# Altium project Proyecto0.PrjPcb (part 2 of 3)

## Sheet FPGA_Banks.SchDoc
size 558 x 431 mm; DrawnBy: Santiago Rodriguez; DocumentNumber: 5; Revision: V1; SheetNumber: 6; SheetTotal: 10
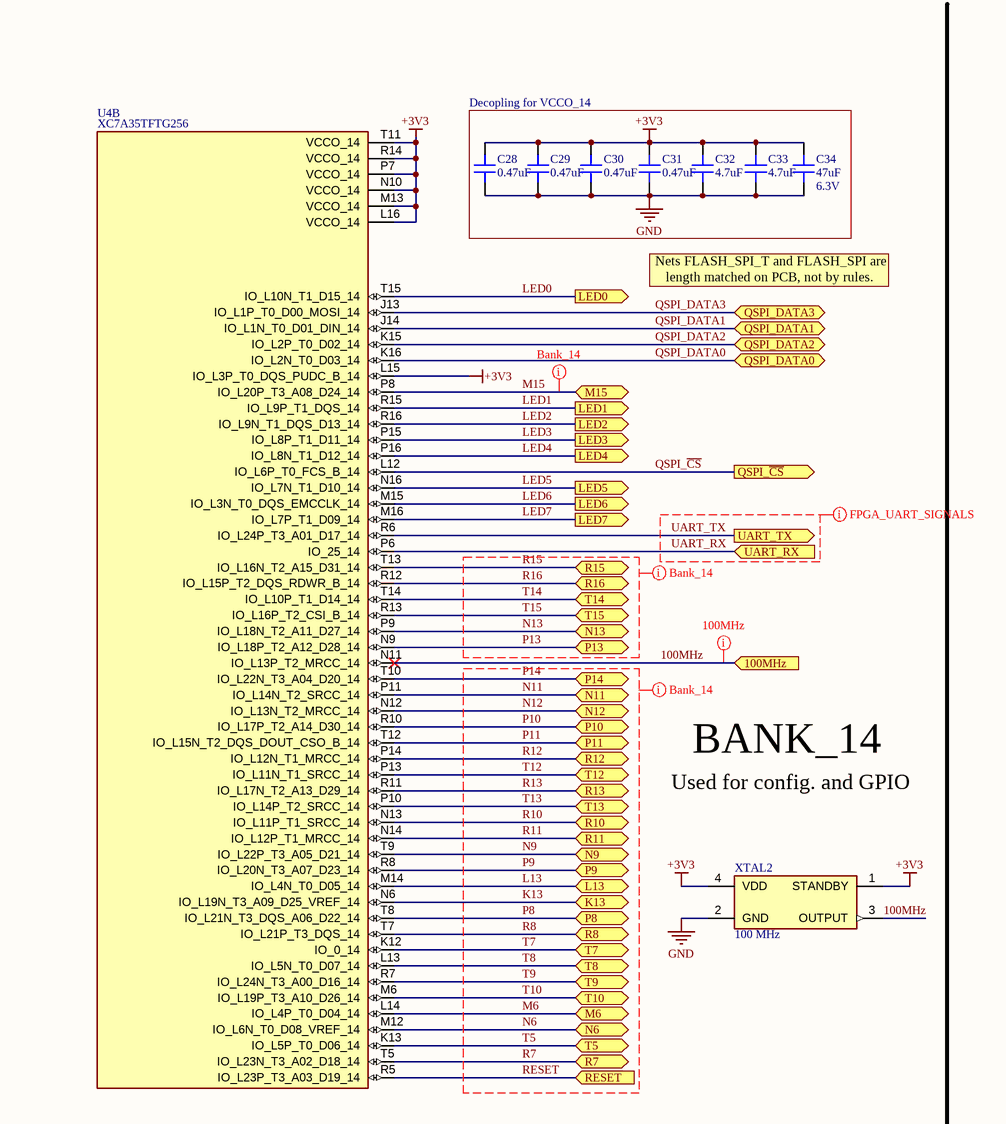
[diagram p6: FPGA_Banks.SchDoc, top left]
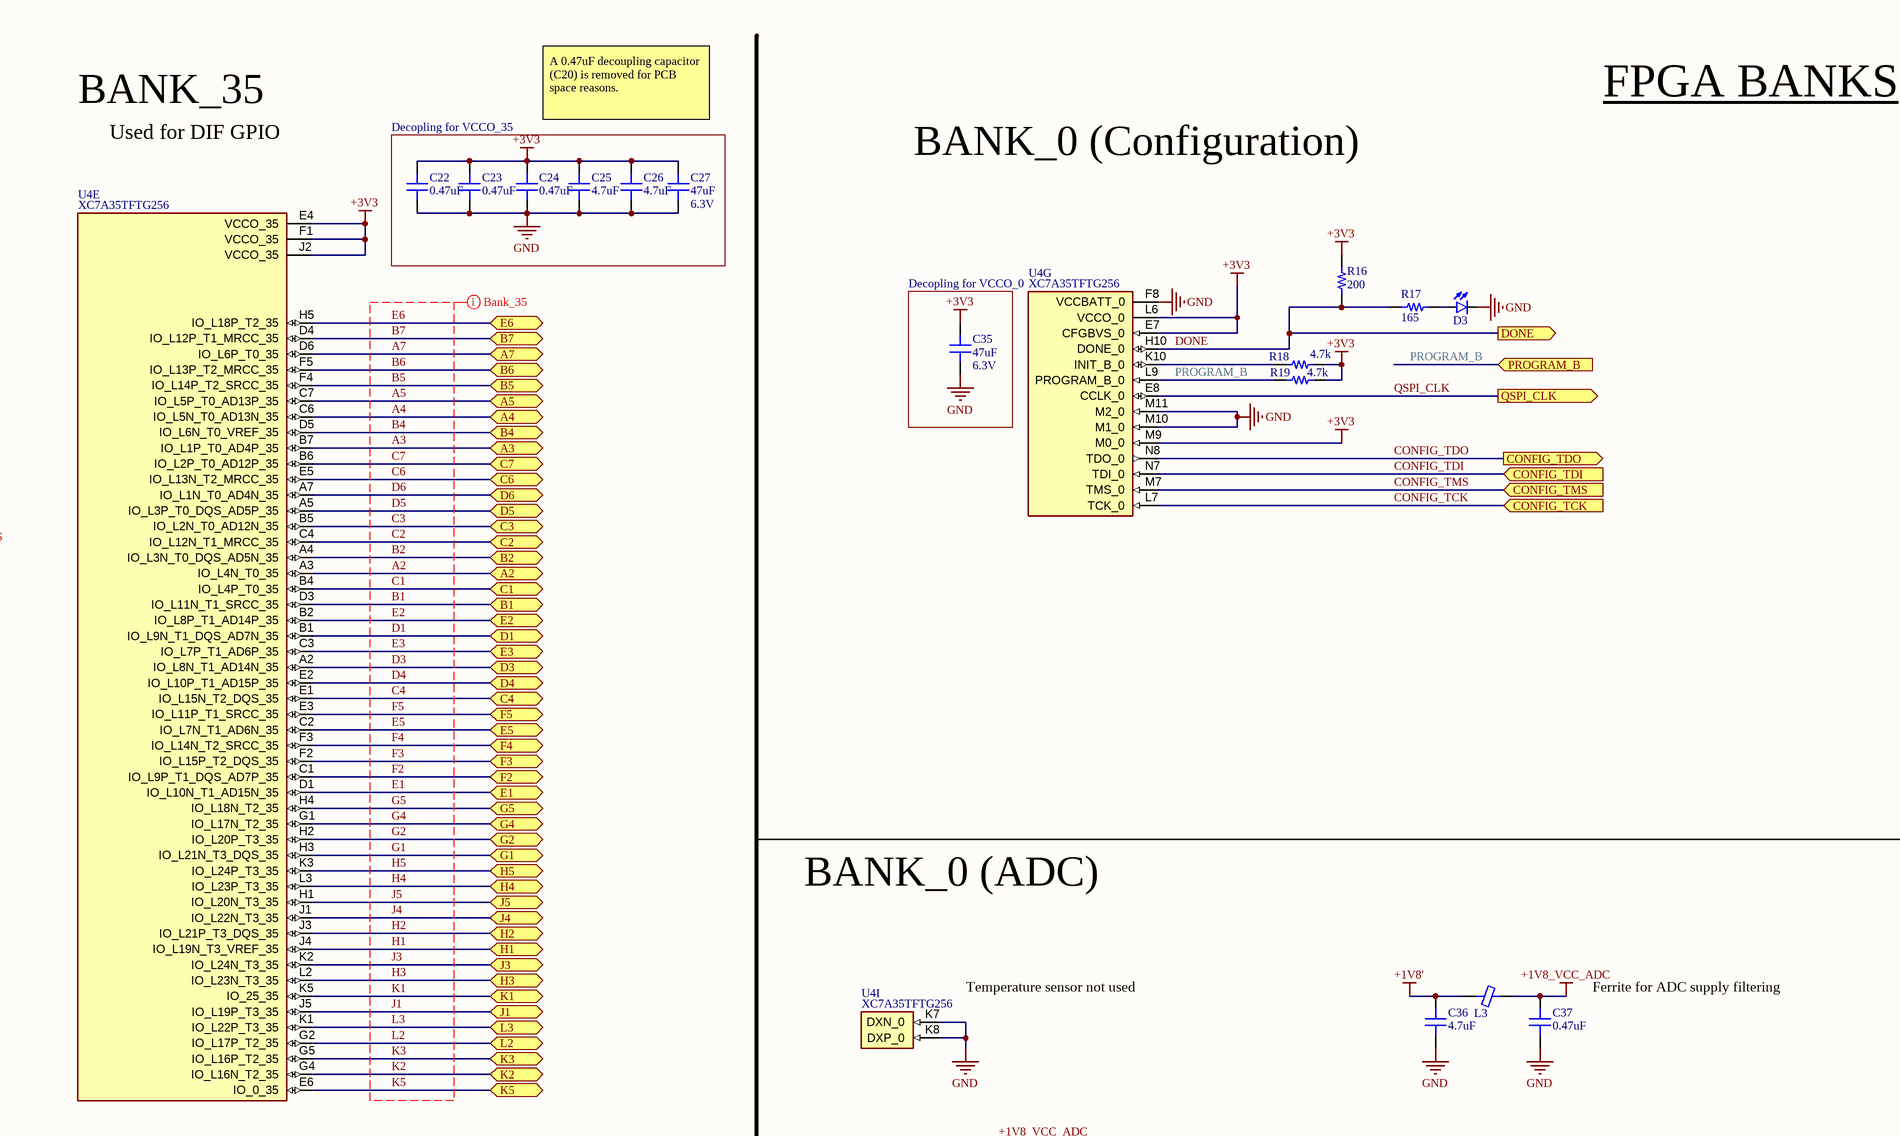
[diagram p7: FPGA_Banks.SchDoc, top right]
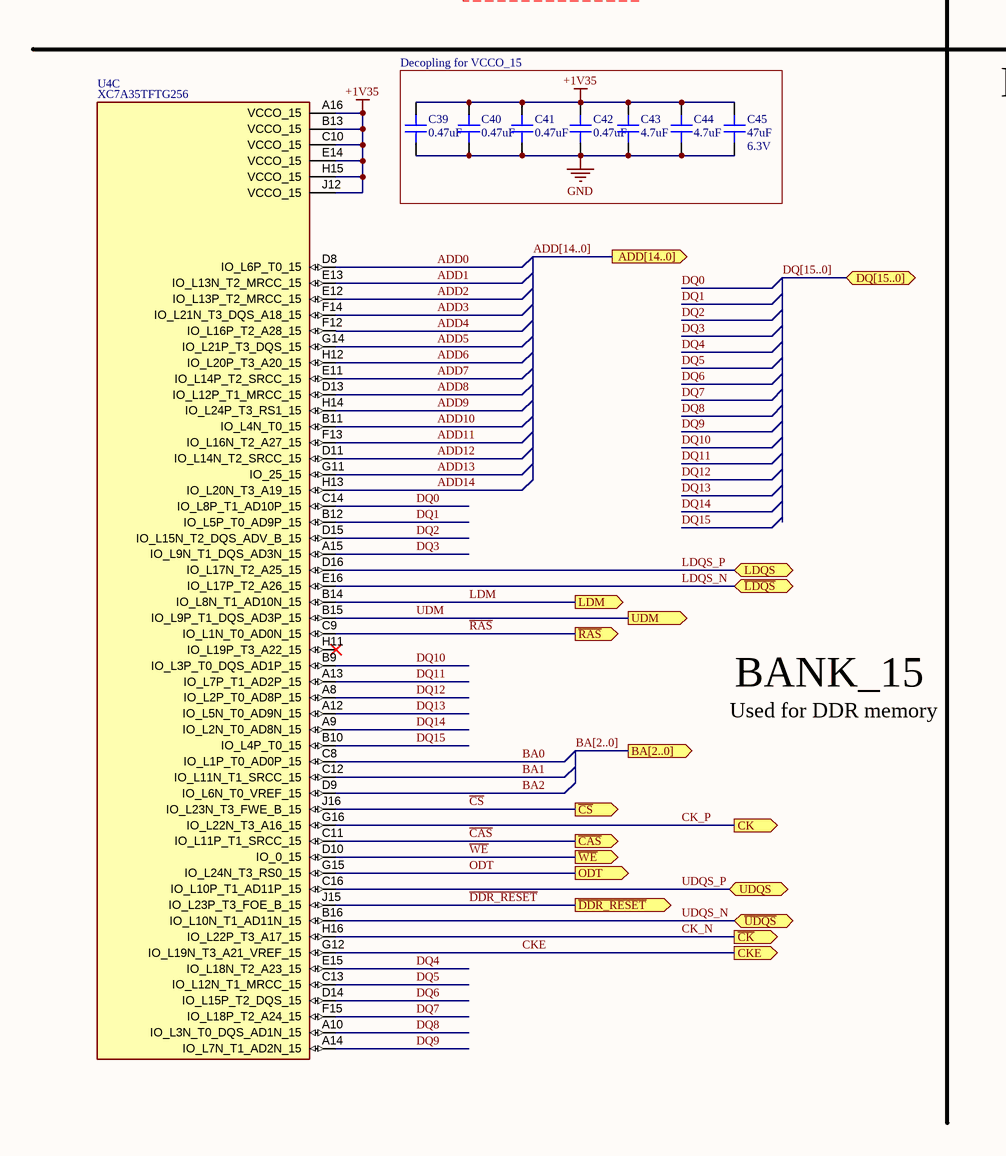
[diagram p8: FPGA_Banks.SchDoc, bottom left]
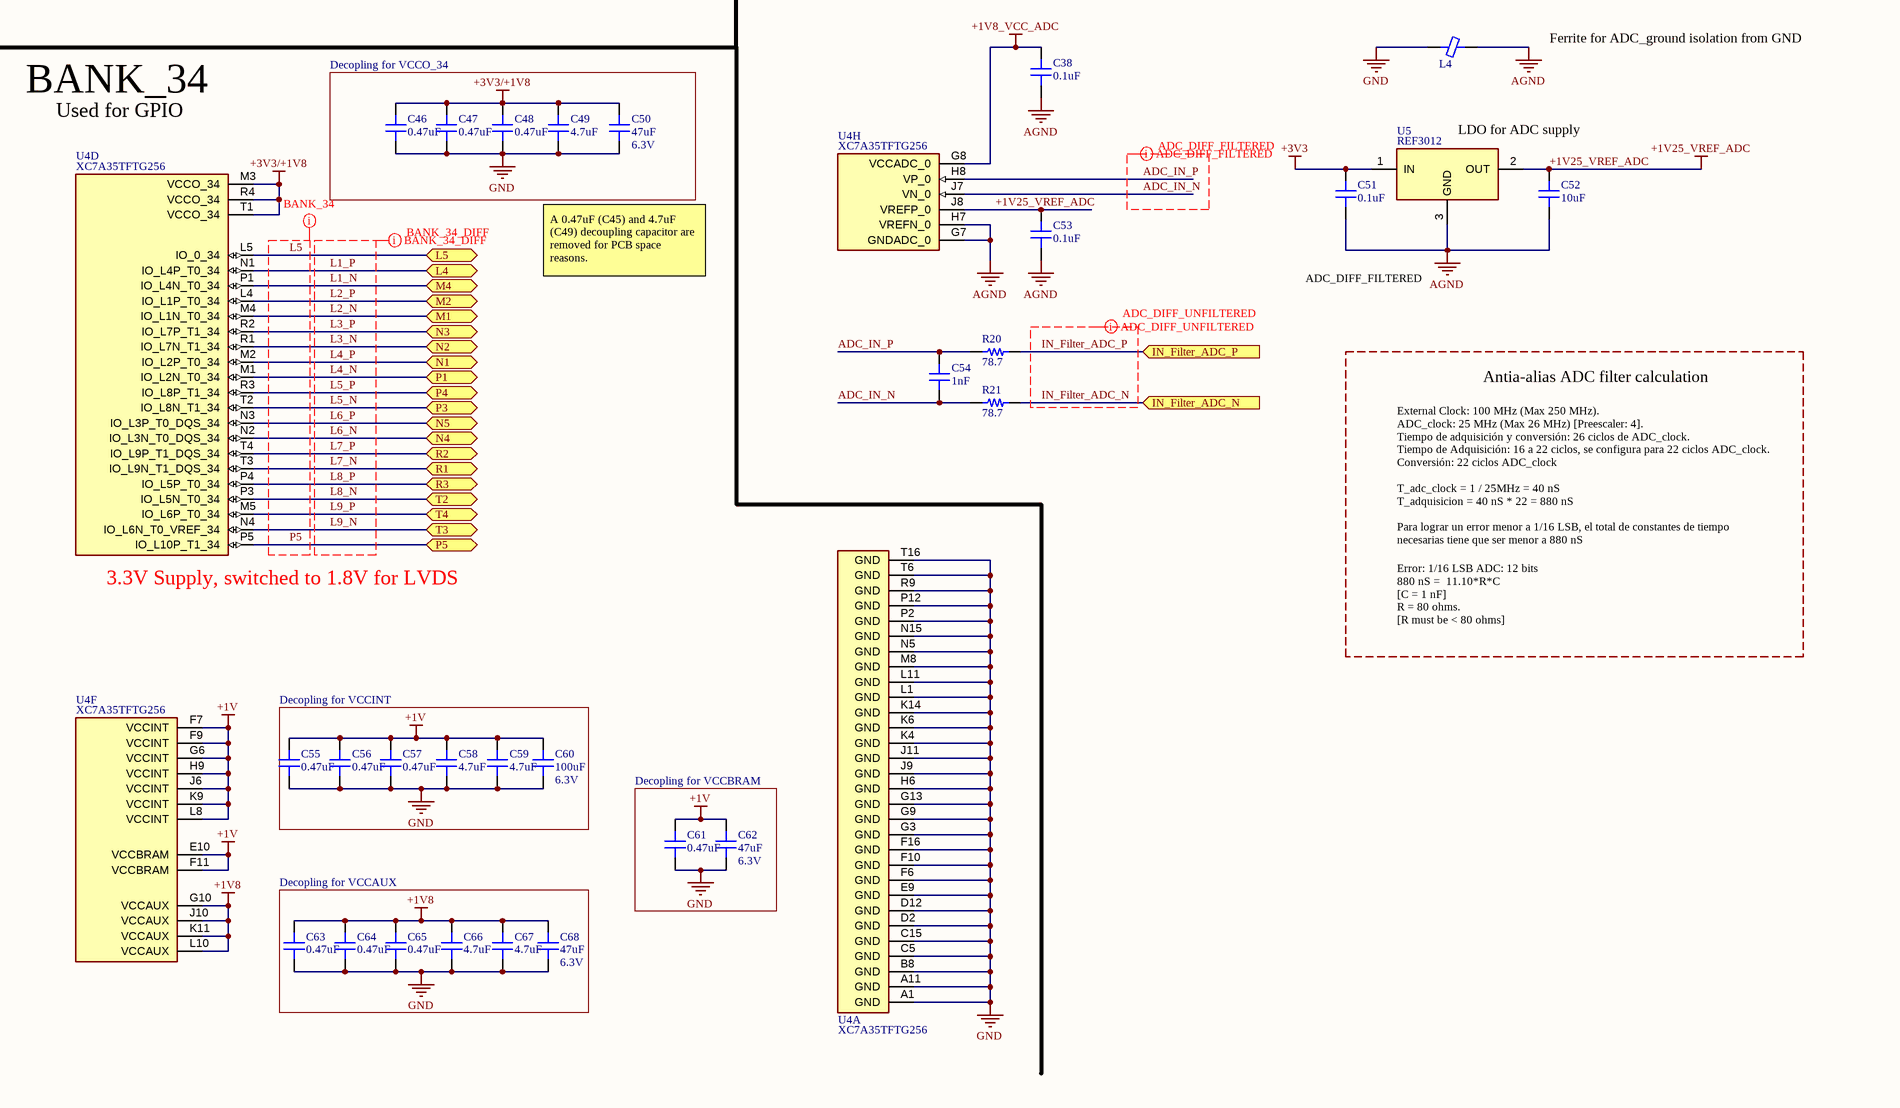
[diagram p9: FPGA_Banks.SchDoc, bottom right]

### Parts
C22  0.47uF  [CAP0402]
C23  0.47uF  [CAP0402]
C24  0.47uF  [CAP0402]
C25  4.7uF  [CAP0402]
C26  4.7uF  [CAP0402]
C27  47uF  Voltage: 6.3V  [CAP0805]
C28  0.47uF  [CAP0402]
C29  0.47uF  [CAP0402]
C30  0.47uF  [CAP0402]
C31  0.47uF  [CAP0402]
C32  4.7uF  [CAP0402]
C33  4.7uF  [CAP0402]
C34  47uF  Voltage: 6.3V  [CAP0805]
C35  47uF  Voltage: 6.3V  [CAP0805]
C36  4.7uF  [CAP0402]
C37  0.47uF  [CAP0402]
C38  0.1uF  [CAP0402]
C39  0.47uF  [CAP0402]
C40  0.47uF  [CAP0402]
C41  0.47uF  [CAP0402]
C42  0.47uF  [CAP0402]
C43  4.7uF  [CAP0402]
C44  4.7uF  [CAP0402]
C45  47uF  Voltage: 6.3V  [CAP0805]
C46  0.47uF  [CAP0402]
C47  0.47uF  [CAP0402]
C48  0.47uF  [CAP0402]
C49  4.7uF  [CAP0402]
C50  47uF  Voltage: 6.3V  [CAP0805]
C51  0.1uF  [CAP0402]
C52  10uF  [CAP0402]
C53  0.1uF  [CAP0402]
C54  1nF  [CAP0402]
C55  0.47uF  [CAP0402]
C56  0.47uF  [CAP0402]
C57  0.47uF  [CAP0402]
C58  4.7uF  [CAP0402]
C59  4.7uF  [CAP0402]
C60  100uF  Voltage: 6.3V  [CAP1206]
C61  0.47uF  [CAP0402]
C62  47uF  Voltage: 6.3V  [CAP0805]
C63  0.47uF  [CAP0402]
C64  0.47uF  [CAP0402]
C65  0.47uF  [CAP0402]
C66  4.7uF  [CAP0402]
C67  4.7uF  [CAP0402]
C68  47uF  Voltage: 6.3V  [CAP0805]
D3  597-3305-607F  [0603_LED]  (value not drawn)
L3  HZ0603C651R-10  [Fer0603]  (value not drawn)
L4  HZ0603C651R-10  [Fer0603]  (value not drawn)
R16  200  [RES0402]
R17  165  [RES0402]
R18  4.7k  [RES0402]
R19  4.7k  [RES0402]
R20  78.7  [RES0402]
R21  78.7  [RES0402]
U4  XC7A35TFTG256  [BGA-256]  (parts A,B,C,D,E,F,G,H,I of 9)
U5  REF3012  [SOT23-3]
XTAL2  Frequency: 100 MHz  [XTAL_ASFLMB]  (hidden comment: ASFLMB-100.000MHZ-LC-T)

### Blocks framed on the sheet
Decopling for VCCO_14: C28-C34
Decopling for VCCO_35: C22-C27
Decopling for VCCO_0: C35
Decopling for VCCO_15: C39-C45
Decopling for VCCO_34: C46-C50
Decopling for VCCINT: C55-C60
Decopling for VCCBRAM: C61 C62
Decopling for VCCAUX: C63-C68

### Ports
100MHz (in), A2 (bidir), A3 (bidir), A4 (bidir), A5 (bidir), A7 (bidir), ADD[14..0] (out), B1 (bidir), B2 (bidir), B4 (bidir), B5 (bidir), B6 (bidir), B7 (bidir), BA[2..0] (out), C1 (bidir), C2 (bidir), C3 (bidir), C4 (bidir), C6 (bidir), C7 (bidir), CK (out), CKE (out), CONFIG_TCK (in), CONFIG_TDI (in), CONFIG_TDO (out), CONFIG_TMS (in), D1 (bidir), D3 (bidir), D4 (bidir), D5 (bidir), D6 (bidir), DONE (out), DQ[15..0] (bidir), E1 (bidir), E2 (bidir), E3 (bidir), E5 (bidir), E6 (bidir), F2 (bidir), F3 (bidir), F4 (bidir), F5 (bidir), G1 (bidir), G2 (bidir), G4 (bidir), G5 (bidir), H1 (bidir), H2 (bidir), H3 (bidir), H4 (bidir), H5 (bidir), IN_Filter_ADC_N (in), IN_Filter_ADC_P (in), J1 (bidir), J3 (bidir), J4 (bidir), J5 (bidir), K1 (bidir), K2 (bidir), K3 (bidir), K5 (bidir), K13 (bidir), L2 (bidir), L3 (bidir), L4 (bidir), L5 (bidir), L13 (bidir), LDM (out), LDQS (bidir), LED0 (out), LED1 (out), LED2 (out), LED3 (out), LED4 (out), LED5 (out), LED6 (out), LED7 (out), M1 (bidir), M2 (bidir), M4 (bidir), M6 (bidir), M15 (bidir), N1 (bidir), N2 (bidir), N3 (bidir), N4 (bidir), N5 (bidir), N6 (bidir), N9 (bidir), N11 (bidir), N12 (bidir), N13 (bidir), ODT (out), P1 (bidir), P3 (bidir), P4 (bidir), P5 (bidir), P8 (bidir), P9 (bidir), P10 (bidir), P11 (bidir), P13 (bidir), P14 (bidir), PROGRAM_B (in), QSPI_CLK (out), QSPI_DATA0 (bidir), QSPI_DATA1 (bidir), QSPI_DATA2 (bidir), QSPI_DATA3 (bidir), QSPI_~{CS} (out), R1 (bidir), R2 (bidir), R3 (bidir), R7 (bidir), R8 (bidir), R10 (bidir), R11 (bidir), R12 (bidir), R13 (bidir), R15 (bidir), R16 (bidir), RESET (in), T2 (bidir), T3 (bidir), T4 (bidir), T5 (bidir), T7 (bidir), T8 (bidir), T9 (bidir), T10 (bidir), T12 (bidir), T13 (bidir), T14 (bidir), T15 (bidir), UART_RX (in), UART_TX (out), UDM (out), UDQS (bidir), ~{CAS} (out), ~{CK} (out), ~{CS} (out), ~{DDR_RESET} (out), ~{LDQS} (bidir), ~{RAS} (out), ~{UDQS} (bidir), ~{WE} (out)

### Nets
+1V: C55.2 C56.2 C57.2 C58.2 C59.2 C60.2 C61.2 C62.2 U4.E10(VCCBRAM) U4.F7(VCCINT) U4.F9(VCCINT) U4.F11(VCCBRAM) U4.G6(VCCINT) U4.H9(VCCINT) U4.J6(VCCINT) U4.K9(VCCINT) U4.L8(VCCINT)
+1V8: C63.2 C64.2 C65.2 C66.2 C67.2 C68.2 U4.G10(VCCAUX) U4.J10(VCCAUX) U4.K11(VCCAUX) U4.L10(VCCAUX)
+1V8': C36.2 L3.1
+1V8_VCC_ADC: C37.2 C38.2 L3.2 U4.G8(VCCADC_0)
+1V25_VREF_ADC: C52.2 C53.2 U4.J8(VREFP_0) U5.2(OUT)
+1V35: C39.2 C40.2 C41.2 C42.2 C43.2 C44.2 C45.2 U4.A16(VCCO_15) U4.B13(VCCO_15) U4.C10(VCCO_15) U4.E14(VCCO_15) U4.H15(VCCO_15) U4.J12(VCCO_15)
+3V3: C22.2 C23.2 C24.2 C25.2 C26.2 C27.2 C28.2 C29.2 C30.2 C31.2 C32.2 C33.2 C34.2 C35.2 C51.2 R16.2 R18.2 R19.2 U4.E4(VCCO_35) U4.E7(CFGBVS_0) U4.F1(VCCO_35) U4.J2(VCCO_35) U4.L6(VCCO_0) U4.L15(IO_L3P_T0_DQS_PUDC_B_14) U4.L16(VCCO_14) U4.M9(M0_0) U4.M13(VCCO_14) U4.N10(VCCO_14) U4.P7(VCCO_14) U4.R14(VCCO_14) U4.T11(VCCO_14) U5.1(IN) XTAL2.1(STANDBY) XTAL2.4(VDD)
+3V3/+1V8: C46.2 C47.2 C48.2 C49.2 C50.2 U4.M3(VCCO_34) U4.R4(VCCO_34) U4.T1(VCCO_34)
AGND: C38.1 C51.1 C52.1 C53.1 L4.2 U4.G7(GNDADC_0) U4.H7(VREFN_0) U5.3(GND)
GND: C22.1 C23.1 C24.1 C25.1 C26.1 C27.1 C28.1 C29.1 C30.1 C31.1 C32.1 C33.1 C34.1 C35.1 C36.1 C37.1 C39.1 C40.1 C41.1 C42.1 C43.1 C44.1 C45.1 C46.1 C47.1 C48.1 C49.1 C50.1 C55.1 C56.1 C57.1 C58.1 C59.1 C60.1 C61.1 C62.1 C63.1 C64.1 C65.1 C66.1 C67.1 C68.1 D3.C L4.1 U4.A1(GND) U4.A11(GND) U4.B8(GND) U4.C5(GND) U4.C15(GND) U4.D2(GND) U4.D12(GND) U4.E9(GND) U4.F6(GND) U4.F8(VCCBATT_0) U4.F10(GND) U4.F16(GND) U4.G3(GND) U4.G9(GND) U4.G13(GND) U4.H6(GND) U4.J9(GND) U4.J11(GND) U4.K4(GND) U4.K6(GND) U4.K7(DXN_0) U4.K8(DXP_0) U4.K14(GND) U4.L1(GND) U4.L11(GND) U4.M8(GND) U4.M10(M1_0) U4.M11(M2_0) U4.N5(GND) U4.N15(GND) U4.P2(GND) U4.P12(GND) U4.R9(GND) U4.T6(GND) U4.T16(GND) XTAL2.2(GND)
100MHz: U4.N11(IO_L13P_T2_MRCC_14) XTAL2.3(OUTPUT) ; port 100MHz
A2: U4.A3(IO_L4N_T0_35) ; port A2
A3: U4.B7(IO_L1P_T0_AD4P_35) ; port A3
A4: U4.C6(IO_L5N_T0_AD13N_35) ; port A4
A5: U4.C7(IO_L5P_T0_AD13P_35) ; port A5
A7: U4.D6(IO_L6P_T0_35) ; port A7
ADC_IN_N: C54.1 R21.1 U4.J7(VN_0)
ADC_IN_P: C54.2 R20.1 U4.H8(VP_0)
ADD0: U4.D8(IO_L6P_T0_15)
ADD1: U4.E13(IO_L13N_T2_MRCC_15)
ADD2: U4.E12(IO_L13P_T2_MRCC_15)
ADD3: U4.F14(IO_L21N_T3_DQS_A18_15)
ADD4: U4.F12(IO_L16P_T2_A28_15)
ADD5: U4.G14(IO_L21P_T3_DQS_15)
ADD6: U4.H12(IO_L20P_T3_A20_15)
ADD7: U4.E11(IO_L14P_T2_SRCC_15)
ADD8: U4.D13(IO_L12P_T1_MRCC_15)
ADD9: U4.H14(IO_L24P_T3_RS1_15)
ADD10: U4.B11(IO_L4N_T0_15)
ADD11: U4.F13(IO_L16N_T2_A27_15)
ADD12: U4.D11(IO_L14N_T2_SRCC_15)
ADD13: U4.G11(IO_25_15)
ADD14: U4.H13(IO_L20N_T3_A19_15)
B1: U4.D3(IO_L11N_T1_SRCC_35) ; port B1
B2: U4.A4(IO_L3N_T0_DQS_AD5N_35) ; port B2
B4: U4.D5(IO_L6N_T0_VREF_35) ; port B4
B5: U4.F4(IO_L14P_T2_SRCC_35) ; port B5
B6: U4.F5(IO_L13P_T2_MRCC_35) ; port B6
B7: U4.D4(IO_L12P_T1_MRCC_35) ; port B7
BA0: U4.C8(IO_L1P_T0_AD0P_15)
BA1: U4.C12(IO_L11N_T1_SRCC_15)
BA2: U4.D9(IO_L6N_T0_VREF_15)
C1: U4.B4(IO_L4P_T0_35) ; port C1
C2: U4.C4(IO_L12N_T1_MRCC_35) ; port C2
C3: U4.B5(IO_L2N_T0_AD12N_35) ; port C3
C4: U4.E1(IO_L15N_T2_DQS_35) ; port C4
C6: U4.E5(IO_L13N_T2_MRCC_35) ; port C6
C7: U4.B6(IO_L2P_T0_AD12P_35) ; port C7
~{CAS}: U4.C11(IO_L11P_T1_SRCC_15) ; port ~{CAS}
~{CS}: U4.J16(IO_L23N_T3_FWE_B_15) ; port ~{CS}
CK_N: U4.H16(IO_L22P_T3_A17_15) ; port ~{CK}
CK_P: U4.G16(IO_L22N_T3_A16_15) ; port CK
CKE: U4.G12(IO_L19N_T3_A21_VREF_15) ; port CKE
CONFIG_TCK: U4.L7(TCK_0) ; port CONFIG_TCK
CONFIG_TDI: U4.N7(TDI_0) ; port CONFIG_TDI
CONFIG_TDO: U4.N8(TDO_0) ; port CONFIG_TDO
CONFIG_TMS: U4.M7(TMS_0) ; port CONFIG_TMS
D1: U4.B1(IO_L9N_T1_DQS_AD7N_35) ; port D1
D3: U4.A2(IO_L8N_T1_AD14N_35) ; port D3
D4: U4.E2(IO_L10P_T1_AD15P_35) ; port D4
D5: U4.A5(IO_L3P_T0_DQS_AD5P_35) ; port D5
D6: U4.A7(IO_L1N_T0_AD4N_35) ; port D6
~{DDR_RESET}: U4.J15(IO_L23P_T3_FOE_B_15) ; port ~{DDR_RESET}
DONE: R16.1 R17.1 U4.H10(DONE_0) ; port DONE
DQ0: U4.C14(IO_L8P_T1_AD10P_15)
DQ1: U4.B12(IO_L5P_T0_AD9P_15)
DQ2: U4.D15(IO_L15N_T2_DQS_ADV_B_15)
DQ3: U4.A15(IO_L9N_T1_DQS_AD3N_15)
DQ4: U4.E15(IO_L18N_T2_A23_15)
DQ5: U4.C13(IO_L12N_T1_MRCC_15)
DQ6: U4.D14(IO_L15P_T2_DQS_15)
DQ7: U4.F15(IO_L18P_T2_A24_15)
DQ8: U4.A10(IO_L3N_T0_DQS_AD1N_15)
DQ9: U4.A14(IO_L7N_T1_AD2N_15)
DQ10: U4.B9(IO_L3P_T0_DQS_AD1P_15)
DQ11: U4.A13(IO_L7P_T1_AD2P_15)
DQ12: U4.A8(IO_L2P_T0_AD8P_15)
DQ13: U4.A12(IO_L5N_T0_AD9N_15)
DQ14: U4.A9(IO_L2N_T0_AD8N_15)
DQ15: U4.B10(IO_L4P_T0_15)
E1: U4.D1(IO_L10N_T1_AD15N_35) ; port E1
E2: U4.B2(IO_L8P_T1_AD14P_35) ; port E2
E3: U4.C3(IO_L7P_T1_AD6P_35) ; port E3
E5: U4.C2(IO_L7N_T1_AD6N_35) ; port E5
E6: U4.H5(IO_L18P_T2_35) ; port E6
F2: U4.C1(IO_L9P_T1_DQS_AD7P_35) ; port F2
F3: U4.F2(IO_L15P_T2_DQS_35) ; port F3
F4: U4.F3(IO_L14N_T2_SRCC_35) ; port F4
F5: U4.E3(IO_L11P_T1_SRCC_35) ; port F5
G1: U4.H3(IO_L21N_T3_DQS_35) ; port G1
G2: U4.H2(IO_L20P_T3_35) ; port G2
G4: U4.G1(IO_L17N_T2_35) ; port G4
G5: U4.H4(IO_L18N_T2_35) ; port G5
H1: U4.J4(IO_L19N_T3_VREF_35) ; port H1
H2: U4.J3(IO_L21P_T3_DQS_35) ; port H2
H3: U4.L2(IO_L23N_T3_35) ; port H3
H4: U4.L3(IO_L23P_T3_35) ; port H4
H5: U4.K3(IO_L24P_T3_35) ; port H5
IN_Filter_ADC_N: R21.2 ; port IN_Filter_ADC_N
IN_Filter_ADC_P: R20.2 ; port IN_Filter_ADC_P
J1: U4.J5(IO_L19P_T3_35) ; port J1
J3: U4.K2(IO_L24N_T3_35) ; port J3
J4: U4.J1(IO_L22N_T3_35) ; port J4
J5: U4.H1(IO_L20N_T3_35) ; port J5
K1: U4.K5(IO_25_35) ; port K1
K2: U4.G4(IO_L16N_T2_35) ; port K2
K3: U4.G5(IO_L16P_T2_35) ; port K3
K5: U4.E6(IO_0_35) ; port K5
K13: U4.N6(IO_L19N_T3_A09_D25_VREF_14) ; port K13
L1_N: U4.P1(IO_L4N_T0_34) ; port M4
L1_P: U4.N1(IO_L4P_T0_34) ; port L4
L2: U4.G2(IO_L17P_T2_35) ; port L2
L2_N: U4.M4(IO_L1N_T0_34) ; port M1
L2_P: U4.L4(IO_L1P_T0_34) ; port M2
L3: U4.K1(IO_L22P_T3_35) ; port L3
L3_N: U4.R1(IO_L7N_T1_34) ; port N2
L3_P: U4.R2(IO_L7P_T1_34) ; port N3
L4_N: U4.M1(IO_L2N_T0_34) ; port P1
L4_P: U4.M2(IO_L2P_T0_34) ; port N1
L5: U4.L5(IO_0_34) ; port L5
L5_N: U4.T2(IO_L8N_T1_34) ; port P3
L5_P: U4.R3(IO_L8P_T1_34) ; port P4
L6_N: U4.N2(IO_L3N_T0_DQS_34) ; port N4
L6_P: U4.N3(IO_L3P_T0_DQS_34) ; port N5
L7_N: U4.T3(IO_L9N_T1_DQS_34) ; port R1
L7_P: U4.T4(IO_L9P_T1_DQS_34) ; port R2
L8_N: U4.P3(IO_L5N_T0_34) ; port T2
L8_P: U4.P4(IO_L5P_T0_34) ; port R3
L9_N: U4.N4(IO_L6N_T0_VREF_34) ; port T3
L9_P: U4.M5(IO_L6P_T0_34) ; port T4
L13: U4.M14(IO_L4N_T0_D05_14) ; port L13
LDM: U4.B14(IO_L8N_T1_AD10N_15) ; port LDM
LDQS_N: U4.E16(IO_L17P_T2_A26_15) ; port ~{LDQS}
LDQS_P: U4.D16(IO_L17N_T2_A25_15) ; port LDQS
LED0: U4.T15(IO_L10N_T1_D15_14) ; port LED0
LED1: U4.R15(IO_L9P_T1_DQS_14) ; port LED1
LED2: U4.R16(IO_L9N_T1_DQS_D13_14) ; port LED2
LED3: U4.P15(IO_L8P_T1_D11_14) ; port LED3
LED4: U4.P16(IO_L8N_T1_D12_14) ; port LED4
LED5: U4.N16(IO_L7N_T1_D10_14) ; port LED5
LED6: U4.M15(IO_L3N_T0_DQS_EMCCLK_14) ; port LED6
LED7: U4.M16(IO_L7P_T1_D09_14) ; port LED7
M6: U4.L14(IO_L4P_T0_D04_14) ; port M6
M15: U4.P8(IO_L20P_T3_A08_D24_14) ; port M15
N6: U4.M12(IO_L6N_T0_D08_VREF_14) ; port N6
N9: U4.T9(IO_L22P_T3_A05_D21_14) ; port N9
N11: U4.P11(IO_L14N_T2_SRCC_14) ; port N11
N12: U4.N12(IO_L13N_T2_MRCC_14) ; port N12
N13: U4.P9(IO_L18N_T2_A11_D27_14) ; port N13
ODT: U4.G15(IO_L24N_T3_RS0_15) ; port ODT
P5: U4.P5(IO_L10P_T1_34) ; port P5
P8: U4.T8(IO_L21N_T3_DQS_A06_D22_14) ; port P8
P9: U4.R8(IO_L20N_T3_A07_D23_14) ; port P9
P10: U4.R10(IO_L17P_T2_A14_D30_14) ; port P10
P11: U4.T12(IO_L15N_T2_DQS_DOUT_CSO_B_14) ; port P11
P13: U4.N9(IO_L18P_T2_A12_D28_14) ; port P13
P14: U4.T10(IO_L22N_T3_A04_D20_14) ; port P14
PROGRAM_B: R19.1 U4.L9(PROGRAM_B_0) ; port PROGRAM_B
QSPI_~{CS}: U4.L12(IO_L6P_T0_FCS_B_14) ; port QSPI_~{CS}
QSPI_CLK: U4.E8(CCLK_0) ; port QSPI_CLK
QSPI_DATA0: U4.K16(IO_L2N_T0_D03_14) ; port QSPI_DATA0
QSPI_DATA1: U4.J14(IO_L1N_T0_D01_DIN_14) ; port QSPI_DATA1
QSPI_DATA2: U4.K15(IO_L2P_T0_D02_14) ; port QSPI_DATA2
QSPI_DATA3: U4.J13(IO_L1P_T0_D00_MOSI_14) ; port QSPI_DATA3
R7: U4.T5(IO_L23N_T3_A02_D18_14) ; port R7
R8: U4.T7(IO_L21P_T3_DQS_14) ; port R8
R10: U4.N13(IO_L11P_T1_SRCC_14) ; port R10
R11: U4.N14(IO_L12P_T1_MRCC_14) ; port R11
R12: U4.P14(IO_L12N_T1_MRCC_14) ; port R12
R13: U4.R11(IO_L17N_T2_A13_D29_14) ; port R13
R15: U4.T13(IO_L16N_T2_A15_D31_14) ; port R15
R16: U4.R12(IO_L15P_T2_DQS_RDWR_B_14) ; port R16
~{RAS}: U4.C9(IO_L1N_T0_AD0N_15) ; port ~{RAS}
RESET: U4.R5(IO_L23P_T3_A03_D19_14) ; port RESET
T5: U4.K13(IO_L5P_T0_D06_14) ; port T5
T7: U4.K12(IO_0_14) ; port T7
T8: U4.L13(IO_L5N_T0_D07_14) ; port T8
T9: U4.R7(IO_L24N_T3_A00_D16_14) ; port T9
T10: U4.M6(IO_L19P_T3_A10_D26_14) ; port T10
T12: U4.P13(IO_L11N_T1_SRCC_14) ; port T12
T13: U4.P10(IO_L14P_T2_SRCC_14) ; port T13
T14: U4.T14(IO_L10P_T1_D14_14) ; port T14
T15: U4.R13(IO_L16P_T2_CSI_B_14) ; port T15
UART_RX: U4.P6(IO_25_14) ; port UART_RX
UART_TX: U4.R6(IO_L24P_T3_A01_D17_14) ; port UART_TX
UDM: U4.B15(IO_L9P_T1_DQS_AD3P_15) ; port UDM
UDQS_N: U4.B16(IO_L10N_T1_AD11N_15) ; port ~{UDQS}
UDQS_P: U4.C16(IO_L10P_T1_AD11P_15) ; port UDQS
~{WE}: U4.D10(IO_0_15) ; port ~{WE}
NetD3_A: D3.A R17.2
NetR18_1: R18.1 U4.K10(INIT_B_0)

Not connected (* = marked no-connect by the designer): U4 H11(IO_L19P_T3_A22_15)*

### Buses and harness runs
bus ADD[14..0] = port ADD[14..0]
bus BA[2..0] = port BA[2..0]
bus DQ[15..0] = port DQ[15..0]

### Layout directives
net class Bank_14: K13, L13, M6, M15, N6, N9, N11, N12, N13, P8, P9, P10, P11, P13, P14, R7, R8, R10, R11, R12, R13, R15, R16, RESET, T5, T7, T8, T9, T10, T12, T13, T14, T15
net class 100MHz: 100MHz
net class Bank_35: A2, A3, A4, A5, A7, B1, B2, B4, B5, B6, B7, C1, C2, C3, C4, C6, C7, D1, D3, D4, D5, D6, E1, E2, E3, E5, E6, F2, F3, F4, F5, G1, G2, G4, G5, H1, H2, H3, H4, H5, J1, J3, J4, J5, K1, K2, K3, K5, L2, L3
differential pair; differential pair class BANK_34_DIFF: L1_N, L1_P, L2_N, L2_P, L3_N, L3_P, L4_N, L4_P, L5_N, L5_P, L6_N, L6_P, L7_N, L7_P, L8_N, L8_P, L9_N, L9_P
net class BANK_34: L5, P5
differential pair; differential pair class ADC_DIFF_FILTERED: ADC_IN_N, ADC_IN_P
differential pair; differential pair class ADC_DIFF_UNFILTERED: IN_Filter_ADC_N, IN_Filter_ADC_P
net class FPGA_UART_SIGNALS: UART_RX, UART_TX

### Notes on the sheet
- BANK_35
- Used for DIF GPIO
- A 0.47uF decoupling capacitor (C20) is removed for PCB space reasons.
- FPGA BANKS
- BANK_0 (Configuration)
- Nets FLASH_SPI_T and FLASH_SPI are
- length matched on PCB, not by rules.
- Used for config. and GPIO
- BANK_14
- BANK_0 (ADC)
- Temperature sensor not used
- Ferrite for ADC supply filtering
- Ferrite for ADC_ground isolation from GND
- BANK_34
- Used for GPIO
- LDO for ADC supply
- A 0.47uF (C45) and 4.7uF (C49) decoupling capacitor are removed for PCB space reasons.
- ADC_DIFF_FILTERED
- Antia-alias ADC filter calculation
- External Clock: 100 MHz (Max 250 MHz).
  ADC_clock: 25 MHz (Max 26 MHz) [Preescaler: 4].
  Tiempo de adquisición y conversión: 26 ciclos de ADC_clock.
  Tiempo de Adquisición: 16 a 22 ciclos, se configura para 22 ciclos ADC_clock.
  Conversión: 22 ciclos ADC_clock
  T_adc_clock = 1 / 25MHz = 40 nS
  T_adquisicion = 40 nS * 22 = 880 nS
  Para lograr un error menor a 1/16 LSB, el total de constantes de tiempo necesarias tiene que ser menor a 880 nS
- (near U4) 3.3V Supply, switched to 1.8V for LVDS
- Used for DDR memory
- BANK_15
- Error: 1/16 LSB	ADC: 12 bits
  880 nS =  11.10*R*C
  [C = 1 nF]
  R = 80 ohms.
  [R must be < 80 ohms]
- Proyect Name:
- Sheet Name:
- Drawn by:
- Date:
- Revision:
- Sheet Number:
- Of

### Library data of the parts
C22-C24 C28-C31 C37 C39-C42 C46-C48 C55-C57 C61 C63-C65 = C0402C474K8RAC: CAP CER 0.47uF 10V X7R 0402 10%; PartNumber: C0603C474K4RAC; Manufacturer: Kemet; ComponentLink1Description: DataSheet; ComponentLink1URL: https://content.kemet.com/datasheets/KEM_C1002_X7R_SMD.pdf; Size: 0402; ComponentLink2Description: DigiKey; ComponentLink2URL: https://www.digikey.com/en/products/filter/ceramic-capacitors/60?s=N4IgTCBcDaIMIAYAsCxyQdiQaQBwCUBBOEAXQF8g; ComponentLink3Description: ProductPage; ComponentLink3URL: https://www.kemet.com/en/us/product/C0805C474K4RACTU.html; Tolerance: 10%; Value: 0.47uF; Voltage: 10 V
C25 C26 C32 C33 C36 C43 C44 C49 C58 C59 C66 C67 = C0402C475M9PAC: CAP CER 4.7uF 6.3V X5R 0402 10%; Manufacturer: Kemet; Voltage: 16V; ComponentLink1Description: DataSheet; ComponentLink1URL: https://content.kemet.com/datasheets/KEM_C1002_X7R_SMD.pdf; Size: 0402; ComponentLink2Description: DigiKey; ComponentLink2URL: https://www.digikey.com/en/products/filter/ceramic-capacitors/60?s=N4IgTCBcDaIMIAYAsCxyQdgKwFsCcADgIYDGIAugL5A; PartNumber: C0402C475M9PAC; ComponentLink3Description: ProdructPage; ComponentLink3URL: https://www.kemet.com/en/us/search.html?q=C0402C475M9PAC; Value: 4.7uF; Tolerance: 10%
C27 C34 C35 C45 C50 C62 C68 = CL21A476MQYNNNE: CAP CER 47uF 6.3V X5R 0805 20%; Manufacturer: Samsung; ComponentLink1Description: DataSheet; ComponentLink1URL: https://mm.digikey.com/Volume0/opasdata/d220001/medias/docus/658/CL21A476MQYNNNE_Spec.pdf; Size: 0805; ComponentLink2Description: DigiKey; ComponentLink2URL: https://www.digikey.com/en/products/detail/samsung-electro-mechanics/CL21A476MQYNNNE/3887510; Value: 47uF; Tolerance: 20%; PartNumber: CL21A476MQYNNNE
C38 C51 C53 = C0402C104K4RAC: as C21 on sheet Flash_Memory; ComponentLink1Description: DataSheet; ComponentLink1URL: https://content.kemet.com/datasheets/KEM_C1002_X7R_SMD.pdf; ComponentLink2Description: DigiKey; ComponentLink2URL: https://www.digikey.com/en/products/filter/ceramic-capacitors/60?s=N4IgTCBcDaIMIAYAsCxwIzINJIEoEE4QBdAXyA; Value: 0.1uF; Tolerance: 10%; Size: 0402; Voltage: 16V; PartNumber: C0402C104K4RAC
C52 = C0402C106M9PAC: CAP CER 10uF 6.3V X5R 0402 10%; Manufacturer: Kemet; ComponentLink1Description: DataSheet; ComponentLink1URL: https://content.kemet.com/datasheets/KEM_C1006_X5R_SMD.pdf; ComponentLink2Description: DigiKey; ComponentLink2URL: https://www.digikey.com/en/products/filter/ceramic-capacitors/60?s=N4IgTCBcDaIMIAYAsCxwIwIGwFkCcACgIJwgC6AvkA; Value: 10uF; Tolerance: 10%; Voltage: 6.3V; Size: 0402; PartNumber: C0402C106M9PAC
C54 = C0402C102K4RAC: CAP CER 1nF 16V X7R 0402 10%; Manufacturer: Kemet; ComponentLink1Description: DataSheet; ComponentLink1URL: https://content.kemet.com/datasheets/KEM_C1002_X7R_SMD.pdf; ComponentLink2Description: DigiKey; ComponentLink2URL: https://www.digikey.com/en/products/filter/ceramic-capacitors/60?s=N4IgTCBcDaIMIAYAsCxwIyoNJIEoEE4QBdAXyA; Value: 1nF; Tolerance: 10%; PartNumber: C0402C102K4RAC; Size: 0402; Voltage: 16V
C60 = C1206C107M9PAC: CAP CER 100uF 6.3V X5R 1206 20%; Manufacturer: Kemet; ComponentLink1Description: DataSheet; ComponentLink1URL: https://www.digikey.com/en/products/detail/kemet/C1206C107M9PAC7210/12700784; Size: 1206; ComponentLink2Description: DigiKey; ComponentLink2URL: https://www.digikey.com/en/products/detail/kemet/C1206C107M9PAC7210/12700784; Value: 100uF; PartNumber: C1206C107M9PAC; Tolerance: 20%
D3 = LED_BLUE_0603: LED blue diffused 0603 SMD; Manufacturer: Würth Elektronik; PartNumber: 150060BS55040; ComponentLink1Description: DataSheet; ComponentLink1URL: https://www.we-online.com/components/products/datasheet/150060BS55040.pdf; ComponentLink2Description: DigiKey; ComponentLink2URL: https://www.digikey.com/es/products/detail/w%C3%BCrth-elektronik/150060BS55040/8557178?s=N4IgTCBcDaIDoBcCMBWADGgbGgQgZRXQBY0QBdAXyA; Colour: Blue; Size: 0603
L3 L4 = HZ0603C651R-10: FERRITE BEAD, 650 OHM, 0603, 1LN, 0603; Manufacturer: Laird-Signal Integrity Products; Z@100MHz: 650 Ohms; Current: 300 mA; DCR: 0.6 Ohm; ComponentLink1Description: DataSheet; ComponentLink1URL: https://www.laird.com/sites/default/files/hz0603c651r-10-datasheet.pdf; ComponentLink2Description: DigiKey; ComponentLink2URL: https://www.digikey.com/es/products/detail/laird-signal-integrity-products/HZ0603C651R-10/806620?s=N4IgTCBcDaIBIC0AMA2JBmAwigrARgCUBaPJEAXQF8g; PartNumber: HZ0603C651R-10; Size: 0603
R16 = CRCW0402200RFK: RES SMD 200 OHM 1% 0.063W 0402; Manufacturer: Vishay; ComponentLink1Description: DataSheet; ComponentLink1URL: https://www.vishay.com/docs/20035/dcrcwe3.pdf; ComponentLink2Description: DigiKey; ComponentLink2URL: https://www.digikey.com/es/products/filter/resistor-de-chip-montaje-en-superficie/52?s=N4IgTCBcDaIMICU4HUAMAWVYytQgYgNIgC6AvkA; Value: 200; Power: 0.063W; PartNumber: CRCW0402200RFK; Tolerance: 1%; Size: 0402
R17 = CRCW0402165RFK: RES SMD 165 OHM 1% 0.063W 0402; Manufacturer: Vishay; ComponentLink1Description: DataSheet; ComponentLink1URL: https://www.vishay.com/docs/20035/dcrcwe3.pdf; ComponentLink2Description: DigiKey; ComponentLink2URL: https://www.digikey.com/es/products/filter/resistor-de-chip-montaje-en-superficie/52?s=N4IgTCBcDaIMICU4HUAMAWVYCMA2ArAgGIDSIAugL5A; Value: 165; Tolerance: 1%; Size: 0402; PartNumber: CRCW0402165RFK; Power: 0.063W
R18 R19 = CRCW04024K70FK: RES SMD 4.7K OHM 1% 0.063W 0402; Manufacturer: Vishay; ComponentLink1Description: DataSheet; ComponentLink1URL: https://www.vishay.com/docs/20035/dcrcwe3.pdf; Size: 0402; ComponentLink2Description: DigiKey; ComponentLink2URL: https://www.digikey.com/es/products/filter/resistor-de-chip-montaje-en-superficie/52?s=N4IgTCBcDaIMICU4HUAMAWVZ0GkDsqAYjiALoC%20QA; Power: 0.063 W; PartNumber: CRCW04024K70FK; Value: 4.7k; Tolerance: 1%
R20 R21 = CRCW040278R7FK: RES SMD 78.7 OHM 1% 0.063W 0402; Manufacturer: Vishay; Value: 78.8; ComponentLink1Description: DataSheet; ComponentLink1URL: https://www.vishay.com/docs/20035/dcrcwe3.pdf; ComponentLink2Description: DigiKey; ComponentLink2URL: https://www.digikey.com/en/products/filter/chip-resistor-surface-mount/52?s=N4IgTCBcDaIMICU4HUAMAWVYDsAOB2AYgNIgC6AvkA; Tolerance: 1%; PartNumber: CRCW040278R7FK; Size: 0402; Power: 0.063W
U4 = XC7A35TFTG256: FPGA - 170 I/O 256FTBGA; Manufacturer: AMD - Xilinx; PartNumber: XC7A35T-xFTG256; ComponentLink1Description: Datasheet; ComponentLink1URL: https://docs.amd.com/v/u/en-US/ds180_7Series_Overview; Package: LBGA-256
U5 = REF3012: Voltage Reference 1.5V; Manufacturer: Texas Instruments; PartNumber: REF3012AIDBZR; ComponentLink1Description: DataSheet; ComponentLink1URL: https://www.ti.com/lit/ds/symlink/ref3012.pdf?ts=1708128926119; ComponentLink2Description: DigiKey; ComponentLink2URL: https://www.digikey.com/en/products/detail/texas-instruments/REF3012AIDBZR/1573905; Package: SOT23-3
XTAL2 = XTAL_100MHz: Crystal 100 MHz; Manufacturer: Abracom; ComponentLink1Description: DataSheet; ComponentLink1URL: https://www.snapeda.com/parts/ASFLMB-100.000MHZ-LC-T/Abracon/datasheet/; PartNumber: ASFLMB-100.000MHZ-LC-T

## Sheet Leds_and_Buttons.SchDoc
size 209 x 148 mm; DrawnBy: Santiago Rodriguez; DocumentNumber: 8; Revision: V1; SheetNumber: 9; SheetTotal: 10
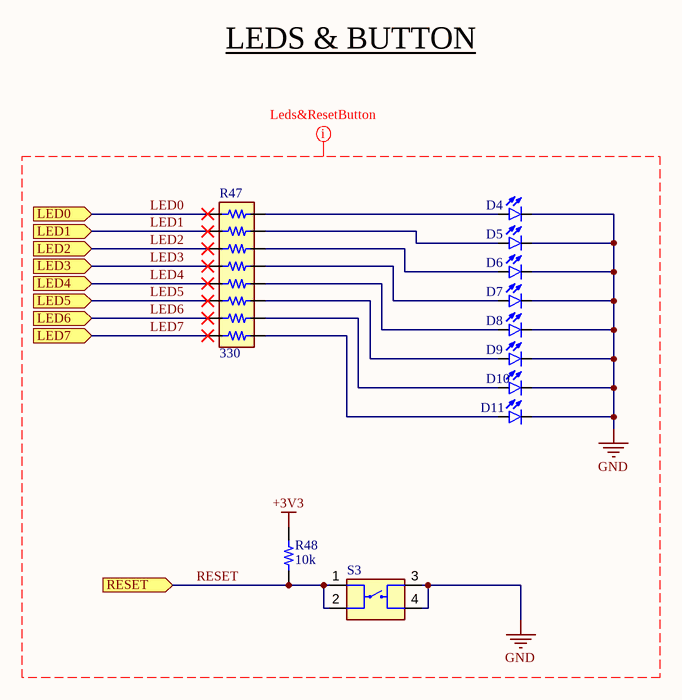
[diagram p10: Leds_and_Buttons.SchDoc]

### Parts
D4  597-3305-607F  [0603_LED]  (value not drawn)
D5  597-3305-607F  [0603_LED]  (value not drawn)
D6  597-3305-607F  [0603_LED]  (value not drawn)
D7  597-3305-607F  [0603_LED]  (value not drawn)
D8  597-3305-607F  [0603_LED]  (value not drawn)
D9  597-3305-607F  [0603_LED]  (value not drawn)
D10  597-3305-607F  [0603_LED]  (value not drawn)
D11  597-3305-607F  [0603_LED]  (value not drawn)
R47  330  [ArrayResistor-1506]
R48  10k  [RES0402]
S3  PTS526SK15SMTR2 LFS  [Push Button]  (value not drawn)

### Ports
LED0 (in), LED1 (in), LED2 (in), LED3 (in), LED4 (in), LED5 (in), LED6 (in), LED7 (in), RESET (in)

### Nets
+3V3: R48.2
GND: D4.C D5.C D6.C D7.C D8.C D9.C D10.C D11.C S3.3 S3.4
LED0: R47.1 ; port LED0
LED1: R47.2 ; port LED1
LED2: R47.3 ; port LED2
LED3: R47.4 ; port LED3
LED4: R47.5 ; port LED4
LED5: R47.6 ; port LED5
LED6: R47.7 ; port LED6
LED7: R47.8 ; port LED7
RESET: R48.1 S3.1 S3.2 ; port RESET
NetD4_A: D4.A R47.16
NetD5_A: D5.A R47.15
NetD6_A: D6.A R47.14
NetD7_A: D7.A R47.13
NetD8_A: D8.A R47.12
NetD9_A: D9.A R47.11
NetD10_A: D10.A R47.10
NetD11_A: D11.A R47.9

### Layout directives
net class Leds&ResetButton: +3V3, GND, LED0, LED1, LED2, LED3, LED4, LED5, LED6, LED7, RESET

### Notes on the sheet
- LEDS & BUTTON
- Proyect Name:
- Sheet Name:
- Drawn by:
- Revision:
- Sheet Number:
- Of
- Date:

### Library data of the parts
D4-D11 = LED_BLUE_0603: as D3 on sheet FPGA_Banks; ComponentLink1Description: DataSheet; ComponentLink1URL: https://www.we-online.com/components/products/datasheet/150060BS55040.pdf; ComponentLink2Description: DigiKey; ComponentLink2URL: https://www.digikey.com/es/products/detail/w%C3%BCrth-elektronik/150060BS55040/8557178?s=N4IgTCBcDaIDoBcCMBWADGgbGgQgZRXQBY0QBdAXyA; Colour: Blue; Size: 0603
R47 = EXB-2HV331JV: RES ARRAY 8 RES 330 OHM 1506; Manufacturer: Panasonic; Elements: 8; Value: 330 Ohms; ComponentLink1Description: DigiKey; ComponentLink1URL: https://www.digikey.com/en/products/detail/panasonic-electronic-components/EXB-2HV331JV/285313?s=N4IgTCBcDaIKIA0BCBaMAJAagZmwRgClMQBdAXyA; ComponentLink2Description: DataSheet; ComponentLink2URL: https://industrial.panasonic.com/cdbs/www-data/pdf/AOC0000/AOC0000C14.pdf; Size: 1506; PartNumber: EXB-2HV331JV
R48 = CRCW040210K0FK: RES SMD 10K OHM 1% 0.063W 0402; Manufacturer: Vishay; ComponentLink1Description: DataSheet; ComponentLink1URL: https://www.vishay.com/docs/20035/dcrcwe3.pdf; Size: 0402; ComponentLink2Description: DigiKey; ComponentLink2URL: https://www.digikey.com/en/products/filter/chip-resistor-surface-mount/52?s=N4IgTCBcDaIMICU4HUAMAWVYCMqDSqAYniALoC%20QA; Value: 10k; Tolerance: 1%; PartNumber: CRCW040210K0FK; Power: 0.063W
S3 = PTS526 SK15 SMTR2 LFS: SWITCH TACTILE, SPST-NO, 0.05A, 12V; Manufacturer: C&K; DigiKey: https://www.digikey.com/es/products/detail/c-k/PTS526-SK15-SMTR2-LFS/10056626; DataSheet: https://www.ckswitches.com/media/2780/pts526.pdf; PartNumber: PTS526SK15SMTR2 LFS

## Sheet Power_Supply.SchDoc
size A4; DrawnBy: Santiago Rodriguez; DocumentNumber: 7; Revision: V1; SheetNumber: 8; SheetTotal: 10
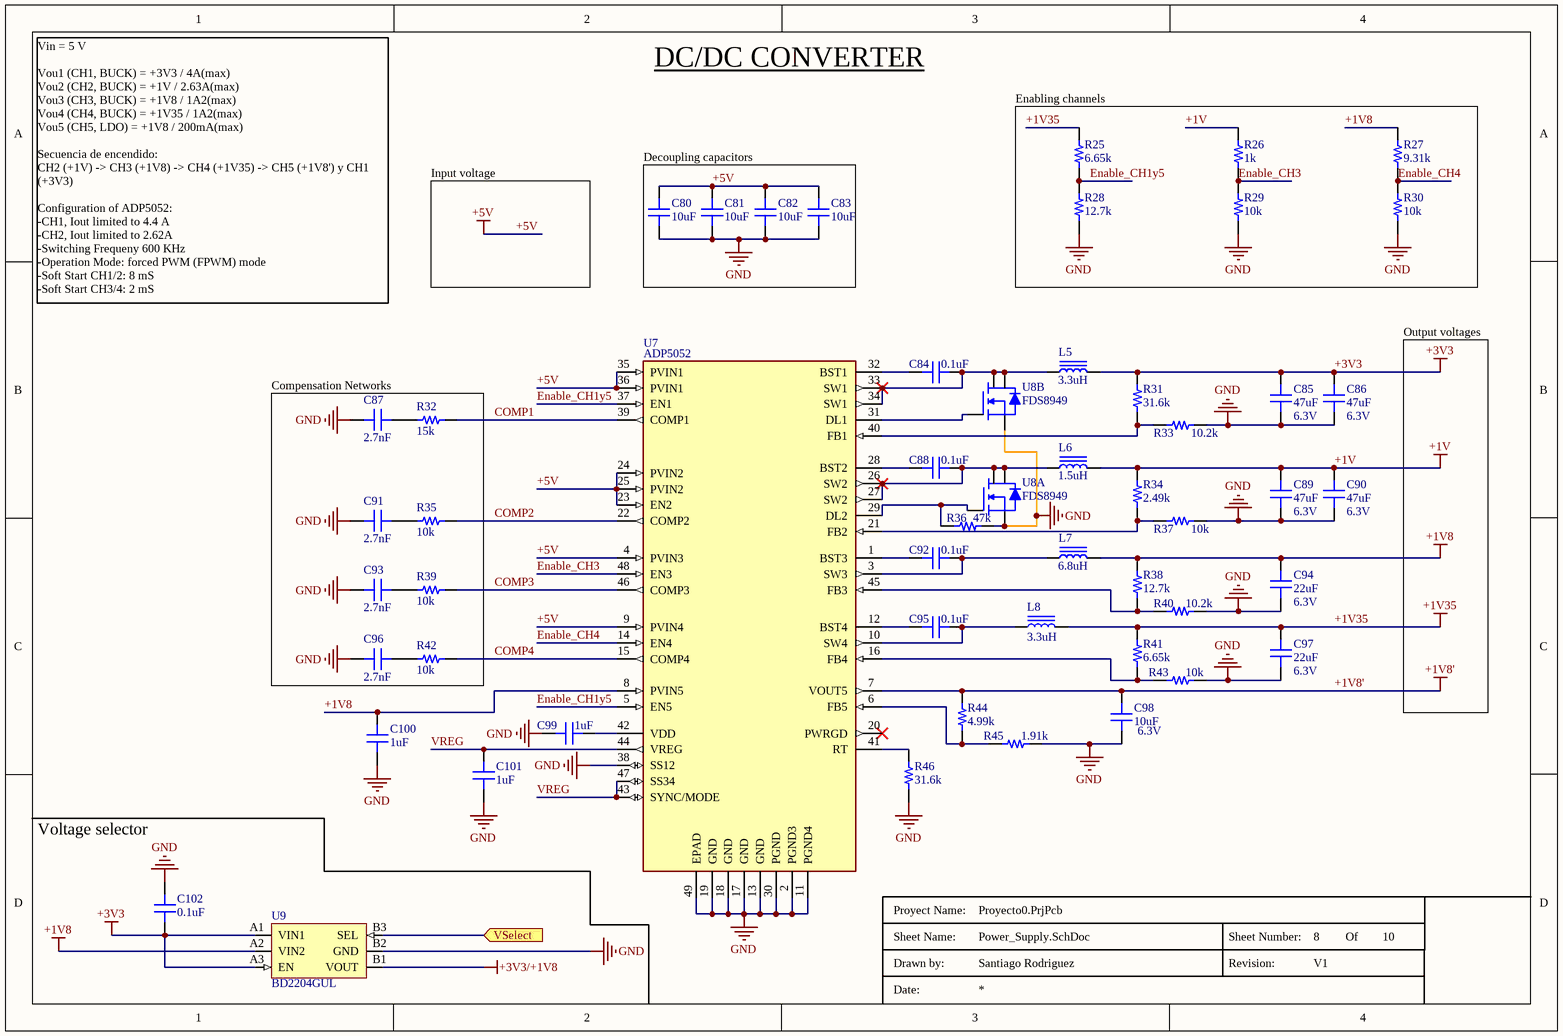
[diagram p11: Power_Supply.SchDoc]

### Parts
C80  10uF  [CAP0805]
C81  10uF  [CAP0805]
C82  10uF  [CAP0805]
C83  10uF  [CAP0805]
C84  0.1uF  [CAP0402]
C85  47uF  Voltage: 6.3V  [CAP0805]
C86  47uF  Voltage: 6.3V  [CAP0805]
C87  2.7nF  [CAP0402]
C88  0.1uF  [CAP0402]
C89  47uF  Voltage: 6.3V  [CAP0805]
C90  47uF  Voltage: 6.3V  [CAP0805]
C91  2.7nF  [CAP0402]
C92  0.1uF  [CAP0402]
C93  2.7nF  [CAP0402]
C94  22uF  Voltage: 6.3V  [CAP0603]
C95  0.1uF  [CAP0402]
C96  2.7nF  [CAP0402]
C97  22uF  Voltage: 6.3V  [CAP0603]
C98  10uF  Voltage: 6.3V  [CAP0603]
C99  1uF  [CAP0402]
C100  1uF  [CAP0402]
C101  1uF  [CAP0402]
C102  0.1uF  [CAP0402]
L5  3.3uH  [IND1616-2.1mm]
L6  1.5uH  [IND1616-2.1mm]
L7  6.8uH  [IND1616-3.1mm]
L8  3.3uH  [IND1616-2.1mm]
R25  6.65k  [RES0603]
R26  1k  [RES0603]
R27  9.31k  [RES0603]
R28  12.7k  [RES0603]
R29  10k  [RES0603]
R30  10k  [RES0603]
R31  31.6k  [RES0402]
R32  15k  [RES0402]
R33  10.2k  [RES0402]
R34  2.49k  [RES0402]
R35  10k  [RES0402]
R36  47k  [RES0603]
R37  10k  [RES0402]
R38  12.7k  [RES0402]
R39  10k  [RES0402]
R40  10.2k  [RES0402]
R41  6.65k  [RES0402]
R42  10k  [RES0402]
R43  10k  [RES0402]
R44  4.99k  [RES0402]
R45  1.91k  [RES0402]
R46  31.6k  [RES0402]
U7  ADP5052  [LFCSP-48]
U8  FDS8949  [SOIC8]  (parts A,B of 2)
U9  BD2204GUL  [UFBGA-6 (VCSP50L1)]

### Blocks framed on the sheet
Enabling channels: R25-R30
Decoupling capacitors: C80-C83
Compensation Networks: C87 C91 C93 C96 R32 R35 R39 R42

### Ports
VSelect (in)

### Nets
+1V: C89.2 C90.2 L6.2 R26.2 R34.2
+1V8: C94.2 C100.2 L7.2 R27.2 R38.2 U7.8(PVIN5) U9.A2(VIN2)
+1V8': C98.2 R44.2 U7.7(VOUT5)
+1V35: C97.2 L8.2 R25.2 R41.2
+3V3: C85.2 C86.2 C102.1 L5.2 R31.2 U9.A1(VIN1) U9.A3(EN)
+3V3/+1V8: U9.B1(VOUT)
+5V: C80.2 C81.2 C82.2 C83.2 U7.4(PVIN3) U7.9(PVIN4) U7.23(EN2) U7.24(PVIN2) U7.25(PVIN2) U7.35(PVIN1) U7.36(PVIN1)
GND: C80.1 C81.1 C82.1 C83.1 C85.1 C86.1 C87.1 C89.1 C90.1 C91.1 C93.1 C94.1 C96.1 C97.1 C98.1 C99.1 C100.1 C101.1 C102.2 R28.1 R29.1 R30.1 R33.2 R36.2 R37.2 R40.2 R43.2 R45.2 R46.1 U7.2(PGND3) U7.11(PGND4) U7.13(GND) U7.17(GND) U7.18(GND) U7.19(GND) U7.30(PGND) U7.38(SS12) U7.49(EPAD) U8.1(S1) U8.3(S2) U9.B2(GND)
COMP1: R32.2 U7.39(COMP1)
COMP2: R35.2 U7.22(COMP2)
COMP3: R39.2 U7.46(COMP3)
COMP4: R42.2 U7.15(COMP4)
Enable_CH1y5: R25.1 R28.2 U7.5(EN5) U7.37(EN1)
Enable_CH3: R26.1 R29.2 U7.48(EN3)
Enable_CH4: R27.1 R30.2 U7.14(EN4)
VREG: C101.2 U7.43(SYNC/MODE) U7.44(VREG) U7.47(SS34)
NetC84_1: C84.1 U7.32(BST1)
NetC84_2: C84.2 L5.1 U7.33(SW1) U7.34(SW1) U8.5(D2) U8.6(D2)
NetC87_2: C87.2 R32.1
NetC88_1: C88.1 U7.28(BST2)
NetC88_2: C88.2 L6.1 U7.26(SW2) U7.27(SW2) U8.7(D1) U8.8(D1)
NetC91_2: C91.2 R35.1
NetC92_1: C92.1 U7.1(BST3)
NetC92_2: C92.2 L7.1 U7.3(SW3)
NetC93_2: C93.2 R39.1
NetC95_1: C95.1 U7.12(BST4)
NetC95_2: C95.2 L8.1 U7.10(SW4)
NetC96_2: C96.2 R42.1
NetC99_2: C99.2 U7.42(VDD)
NetCNT4_27: U9.B3(SEL) ; port VSelect
NetR31_1: R31.1 R33.1 U7.40(FB1)
NetR34_1: R34.1 R37.1 U7.21(FB2)
NetR36_1: R36.1 U7.29(DL2) U8.2(G1)
NetR38_1: R38.1 R40.1 U7.45(FB3)
NetR41_1: R41.1 R43.1 U7.16(FB4)
NetR44_1: R44.1 R45.1 U7.6(FB5)
NetR46_2: R46.2 U7.41(RT)
NetU7_31: U7.31(DL1) U8.4(G2)

Not connected (* = marked no-connect by the designer): U7 20(PWRGD)*

### Notes on the sheet
- DC/DC CONVERTER
- Input voltage
- Vin = 5 V
  Vou1 (CH1, BUCK) = +3V3 / 4A(max)
  Vou2 (CH2, BUCK) = +1V / 2.63A(max)
  Vou3 (CH3, BUCK) = +1V8 / 1A2(max)
  Vou4 (CH4, BUCK) = +1V35 / 1A2(max)
  Vou5 (CH5, LDO) = +1V8 / 200mA(max)
  Secuencia de encendido:
  CH2 (+1V) -> CH3 (+1V8) -> CH4 (+1V35) -> CH5 (+1V8') y CH1 (+3V3)
  Configuration of ADP5052:
  -CH1, Iout limited to 4.4 A
  -CH2, Iout limited to 2.62A
  -Switching Frequeny 600 KHz
  -Operation Mode: forced PWM (FPWM) mode
  -Soft Start CH1/2: 8 mS
  -Soft Start CH3/4: 2 mS
- Output voltages
- Voltage selector
- Proyect Name:
- Sheet Name:
- Drawn by:
- Revision:
- Sheet Number:
- Of
- Date:

### Library data of the parts
C80-C83 = C0805C106M3PACTU: CAP CER 10UF 25V X5R 0805 10%; Manufacturer: Kemet; ComponentLink1Description: DataSheet; ComponentLink1URL: https://content.kemet.com/datasheets/KEM_C1006_X5R_SMD.pdf; ComponentLink2Description: DigiKey; ComponentLink2URL: https://www.digikey.com/en/products/detail/kemet/C0805C106M3PACTU/5267534; Value: 10uF; Tolerance: 10%; Voltage: 25V; Size: 0805; PartNumber: C0805C106M3PACTU
C84 C88 C92 C95 C102 = C0402C104K4RAC: CAP CER 0.1uF 16V X7R 0402 10%; Manufacturer: Kemet; ComponentLink1Description: DataSheet; ComponentLink1URL: https://content.kemet.com/datasheets/KEM_C1002_X7R_SMD.pdf; ComponentLink2Description: DigiKey; ComponentLink2URL: https://www.digikey.com/en/products/filter/ceramic-capacitors/60?s=N4IgTCBcDaIMIAYAsCxwIzINJIEoEE4QBdAXyA; Value: 0.1uF; Tolerance: 10%; Size: 0402; Voltage: 16V; PartNumber: C0402C104K4RAC
C85 C86 C89 C90 = CL21A476MQYNNNE: CAP CER 47uF 6.3V X5R 0805 20%; Manufacturer: Samsung; ComponentLink1Description: DataSheet; ComponentLink1URL: https://mm.digikey.com/Volume0/opasdata/d220001/medias/docus/658/CL21A476MQYNNNE_Spec.pdf; Size: 0805; ComponentLink2Description: DigiKey; ComponentLink2URL: https://www.digikey.com/en/products/detail/samsung-electro-mechanics/CL21A476MQYNNNE/3887510; Value: 47uF; Tolerance: 20%; PartNumber: CL21A476MQYNNNE
C87 C91 C93 C96 = C0402C272K5RAC: CAP CER 2.7nF 50V X7R 0402 10%; Manufacturer: Kemet; Value: 2.2nF; ComponentLink1Description: DataSheet; ComponentLink1URL: https://content.kemet.com/datasheets/KEM_C1002_X7R_SMD.pdf; ComponentLink2Description: DigiKey; ComponentLink2URL: https://www.digikey.com/en/products/filter/ceramic-capacitors/60?s=N4IgTCBcDaIMIAYAsCxzAdjAaQKwCUBBOEAXQF8g; Tolerance: 10%; PartNumber: C0402C272K5RAC; Voltage: 50V; Size: 0402
C94 C97 = GRM188R60J226MEA0D: CAP CER 22UF 6.3V X5R 0603; Manufacturer: Murata; ComponentLink1Description: DataSheet; ComponentLink1URL: https://search.murata.co.jp/Ceramy/image/img/A01X/G101/ENG/GRM188R60J226MEA0-01.pdf; Size: 0603; ComponentLink2Description: DigiKey; ComponentLink2URL: https://www.digikey.com/en/products/detail/murata-electronics/GRM188R60J226MEA0D/4280542; PartNumber: GRM188R60J226MEA0D
C98 = C0603C106M9PAC: CAP CER 10uF 6.3V X5R 0603 10%; Manufacturer: Kemet; ComponentLink1Description: DataSheet; ComponentLink1URL: https://content.kemet.com/datasheets/KEM_C1006_X5R_SMD.pdf; Size: 0603; ComponentLink2Description: DigiKey; ComponentLink2URL: https://www.digikey.com/en/products/detail/kemet/C0603C106M9PAC7867/1950664; Value: 10uF; Tolerance: 10%; PartNumber: C0603C106M9PAC
C99-C101 = C0402C105K4RAC: CAP CER 1uF 16V X7R 0402 10%; Manufacturer: Kemet; ComponentLink1Description: DataSheet; ComponentLink1URL: https://content.kemet.com/datasheets/KEM_C1002_X7R_SMD.pdf; Size: 0402; ComponentLink2Description: DigiKey; ComponentLink2URL: https://www.digikey.com/en/products/detail/kemet/C0402C105K4RAC7867/22058709?s=N4IgTCBcDaIMIAYAsCxwIwIKwGkkCUBBOEAXQF8g; Value: 1uF; Tolerance: 10%; Voltage: 16V; PartNumber: C0402C105K4RAC
L5 L8 = XFL4020-332ME: FIXED IND, 3.3uH, 5.2A, 38.3mOHM, SMD; Manufacturer: Coilcraft; ComponentLink1Description: DigiKey; ComponentLink1URL: https://www.digikey.com/en/products/detail/coilcraft/XFL4020-332MEC/21381630?s=N4IgTCBcDaIBoDEAyAWADGNBaAzDiAugL5A; ComponentLink2Description: DataSheet; ComponentLink2URL: https://www.coilcraft.com/getmedia/50632d43-da1b-4cdb-8ab4-3029cab51df3/xfl4020.pdf; Size: 1616; PartNumber: XFL4020-332ME
L6 = XFL4020-152ME: FIXED IND, 1.5uH, 9.1A, 15.8mOHM, SMD; Manufacturer: Coilcraft; ComponentLink1Description: DigiKey; ComponentLink1URL: https://www.digikey.at/en/products/detail/coilcraft/XFL4020-152MEC/21387736; ComponentLink2Description: DataSheet; ComponentLink2URL: https://www.coilcraft.com/getmedia/50632d43-da1b-4cdb-8ab4-3029cab51df3/xfl4020.pdf; Size: 1616; PartNumber: XFL4020-152ME
L7 = XAL4030-682ME: FIXED IND, 6.8uH, 3.9A, 74.1mOHM, SMD; Manufacturer: Coilcraft; ComponentLink1Description: DigiKey; ComponentLink1URL: https://www.digikey.com/en/products/detail/coilcraft/XAL4030-682MEC/21381592; ComponentLink2Description: DataSheet; ComponentLink2URL: https://www.coilcraft.com/en-us/files/datasheet/XAL40xx; Size: 1616; PartNumber: XAL4030-682ME
R25 = CRCW06036K65FK: RES SMD 6.65K OHM 1% 1/10W 0603; Manufacturer: Vishay; Power: 0.1W; ComponentLink1Description: DataSheet; ComponentLink1URL: https://www.vishay.com/docs/20035/dcrcwe3.pdf; Size: 0603; ComponentLink2Description: DigiKey; ComponentLink2URL: https://www.digikey.com/en/products/detail/vishay-dale/CRCW06036K65FKEA/1174762; Value: 6.65k; Tolerance: 1%; PartNumber: CRCW06036K65FK
R26 = CRCW06031K00FK: RES SMD 1K OHM 1% 1/10W 0603; Manufacturer: Vishay; Power: 0.1W; ComponentLink1Description: DigiKey; ComponentLink1URL: https://www.digikey.com/es/products/detail/vishay-dale/CRCW06031K00FKEA/1174668; ComponentLink2Description: DataSheet; ComponentLink2URL: https://www.vishay.com/docs/20035/dcrcwe3.pdf; Size: 0603; Value: 1k; Tolerance: 1%; PartNumber: CRCW06031K00FK
R27 = CRCW06039K31FK: RES SMD 9.31K OHM 1% 1/10W 0603; Manufacturer: Vishay; Power: 0.1W; ComponentLink1Description: DataSheet; ComponentLink1URL: https://www.vishay.com/docs/20035/dcrcwe3.pdf; Size: 0603; ComponentLink2Description: DigiKey; ComponentLink2URL: https://www.digikey.com/es/products/detail/vishay-dale/CRCW06039K31FKEA/1174779; Value: 9.31k; Tolerance: 1%; PartNumber: CRCW06039K31FK
R28 = CRCW060312K7FK: RES SMD 12.7K OHM 1% 1/10W 0603; Manufacturer: Vishay; Power: 0.1W; ComponentLink1Description: DataSheet; ComponentLink1URL: https://www.vishay.com/docs/20035/dcrcwe3.pdf; Size: 0603; ComponentLink2Description: DigiKey; ComponentLink2URL: https://www.digikey.com/en/products/detail/vishay-dale/CRCW060312K7FKEA/1174793; Value: 12.7k; Tolerance: 1%; PartNumber: CRCW060312K7FK
R29 R30 = CRCW060310K0FK: RES SMD 10K OHM 1% 1/10W 0603; Manufacturer: Vishay; Power: 0.1W; ComponentLink1Description: DataSheet; ComponentLink1URL: https://www.vishay.com/docs/20035/dcrcwe3.pdf; Size: 0603; ComponentLink2Description: DigiKey; ComponentLink2URL: https://www.digikey.com/en/products/detail/vishay-dale/CRCW060310K0FKEA/1174782; Value: 10k; Tolerance: 1%; PartNumber: CRCW060310K0FK
R31 R46 = CRCW040231K6FK: RES SMD 31.6K OHM 1% 0.063W 0402; Manufacturer: Vishay; ComponentLink1Description: DataSheet; ComponentLink1URL: https://www.vishay.com/docs/20035/dcrcwe3.pdf; Size: 0402; ComponentLink2Description: DigiKey; ComponentLink2URL: https://www.digikey.com/en/products/filter/chip-resistor-surface-mount/52?s=N4IgTCBcDaIMICU4HUAMAWVYDMBGA0gGwBi%20IAugL5A; Power: 0.063W; Tolerance: 1%; Value: 31.6k; PartNumber: CRCW040231K6FK
R32 = CRCW040215K0FK: RES SMD 15K OHM 1% 0.063W 0402; Manufacturer: Vishay; ComponentLink1Description: DataSheet; ComponentLink1URL: https://www.vishay.com/docs/20035/dcrcwe3.pdf; Size: 0402; ComponentLink2Description: DigiKey; ComponentLink2URL: https://www.digikey.com/en/products/filter/chip-resistor-surface-mount/52?s=N4IgTCBcDaIMICU4HUAMAWVYCMBWA0qgGL4gC6AvkA; Power: 0.063W; Tolerance: 1%; PartNumber: CRCW040215K0FK; Value: 15k
R33 R40 = CRCW040210K2FK: RES SMD 10.2K OHM 1% 0.063W 0402; Manufacturer: Vishay; ComponentLink1Description: DataSheet; ComponentLink1URL: https://www.vishay.com/docs/20035/dcrcwe3.pdf; Size: 0402; ComponentLink2Description: DigiKey; ComponentLink2URL: https://www.digikey.com/en/products/filter/chip-resistor-surface-mount/52?s=N4IgTCBcDaIMICU4HUAMAWVYCMqDSYAYniALoC%20QA; Value: 10.2k; Power: 0.063W; Tolerance: 1%; PartNumber: CRCW040210K2FK
R34 = CRCW04022K49FK: RES SMD 2.49K OHM 1% 0.063W 0402; Manufacturer: Vishay; ComponentLink1Description: DataSheet; ComponentLink1URL: https://www.vishay.com/docs/20035/dcrcwe3.pdf; Size: 0402; ComponentLink2Description: DigiKey; ComponentLink2URL: https://www.digikey.com/en/products/filter/chip-resistor-surface-mount/52?s=N4IgTCBcDaIMICU4HUAMAWVYwGl0E4AxHEAXQF8g; Value: 2.49k; Tolerance: 1%; Power: 0.063W; PartNumber: CRCW04022K49FK
R35 R37 R39 R42 R43 = CRCW040210K0FK: RES SMD 10K OHM 1% 0.063W 0402; Manufacturer: Vishay; ComponentLink1Description: DataSheet; ComponentLink1URL: https://www.vishay.com/docs/20035/dcrcwe3.pdf; Size: 0402; ComponentLink2Description: DigiKey; ComponentLink2URL: https://www.digikey.com/en/products/filter/chip-resistor-surface-mount/52?s=N4IgTCBcDaIMICU4HUAMAWVYCMqDSqAYniALoC%20QA; Value: 10k; Tolerance: 1%; PartNumber: CRCW040210K0FK; Power: 0.063W
R36 = CRCW060347K0FK: RES SMD 47K OHM 1% 1/10W 0603; Manufacturer: Vishay; Power: 0.1W; ComponentLink1Description: DataSheet; ComponentLink1URL: https://www.vishay.com/docs/20035/dcrcwe3.pdf; Size: 0603; ComponentLink2Description: DigiKey; ComponentLink2URL: https://www.digikey.com/es/products/detail/vishay-dale/CRCW060347K0FKEA/1174858; Value: 47k; Tolerance: 1%; PartNumber: CRCW060347K0FK
R38 = CRCW040212K7FK: RES SMD 12.7K OHM 1% 0.063W 0402; Manufacturer: Vishay; PartNumber: CRCW060312K7FK; ComponentLink1Description: DataSheet; ComponentLink1URL: https://www.vishay.com/docs/20035/dcrcwe3.pdf; Size: 0402; ComponentLink2Description: DigiKey; ComponentLink2URL: https://www.digikey.com/en/products/filter/chip-resistor-surface-mount/52?s=N4IgTCBcDaIMICU4HUAMAWVYCMYDSA7AGJ4gC6AvkA; Value: 12.7k; Tolerance: 1%; Power: 0.063W
R41 = CRCW04026K65FK: RES SMD 6.65K OHM 1% 0.063W 0402; Manufacturer: Vishay; ComponentLink1Description: DataSheet; ComponentLink1URL: https://www.vishay.com/docs/20035/dcrcwe3.pdf; ComponentLink2Description: DigiKey; ComponentLink2URL: https://www.digikey.com/en/products/filter/chip-resistor-surface-mount/52?s=N4IgTCBcDaIMICU4HUAMAWVYBsBpbArAGK4gC6AvkA; Tolerance: 1%; Power: 0.063W; PartNumber: CRCW04026K65FK; Value: 6.65k; Size: 0402
R44 = CRCW04024K99FK: RES SMD 4.99K OHM 1% 0.063W 0402; Manufacturer: Vishay; ComponentLink1Description: DataSheet; ComponentLink1URL: https://www.vishay.com/docs/20035/dcrcwe3.pdf; Size: 0402; ComponentLink2Description: DigiKey; ComponentLink2URL: https://www.digikey.com/en/products/filter/chip-resistor-surface-mount/52?s=N4IgTCBcDaIMICU4HUAMAWVZ0GkCceAYjiALoC%20QA; Value: 4.99k; Tolerance: 1%; Power: 0.063W; PartNumber: CRCW04024K99FK
R45 = CRCW04021K91FK: RES SMD 1.91K OHM 1% 0.063W 0402; Manufacturer: Vishay; ComponentLink1Description: DataSheet; ComponentLink1URL: https://www.vishay.com/docs/20035/dcrcwe3.pdf; Size: 0402; ComponentLink2Description: Digikey; ComponentLink2URL: https://www.digikey.com/en/products/filter/chip-resistor-surface-mount/52?s=N4IgTCBcDaIMICU4HUAMAWVYCMBpAnNgGK4gC6AvkA; Value: 1.91k; Tolerance: 1%; Power: 0.063W; PartNumber: CRCW04021K91FK
U7 = ADP5052: 5-Channel Integrated Power Solution with Quad Buck Regulators and 200 mA LDO Regulator; Manufacturer: Analog Devices; PartNumber: ADP5052ACPZ-R7; ComponentLink1Description: DataSheet; ComponentLink1URL: https://www.analog.com/media/en/technical-documentation/data-sheets/adp5052.pdf; ComponentLink2Description: DigiKey; ComponentLink2URL: https://www.digikey.com/en/products/detail/analog-devices-inc/ADP5052ACPZ-R7/4171709?s=N4IgTCBcDaIIIBEAKBWADCiBdAvkA; Package: LFCSP-48
U8 = FDS8949: MOSFET 2N-CH 40V 6A 8SOIC; Manufacturer: Onsemi; ComponentLink1Description: Datahseet; ComponentLink1URL: https://www.onsemi.com/pdf/datasheet/fds8949-d.pdf; ComponentLink2Description: DigiKey; ComponentLink2URL: https://www.digikey.com/en/products/detail/onsemi/FDS8949/1217883; Package: SOIC-8; PartNumber: FDS8949
U9 = BD2204GUL: Power Supply Selector Switch IC for SD Cards; PartNumber: BD2204GUL-E2; Manufacturer: ROHM; Package: UFBGA-6; ComponentLink1Description: ProductPage; ComponentLink1URL: https://www.rohm.com/products/power-management/power-management-switch-ics/load-switch-ics/bd2204gul-product; ComponentLink2Description: DataSheet; ComponentLink2URL: https://fscdn.rohm.com/en/products/databook/datasheet/ic/power/power_switch/bd2204gul-e.pdf; ComponentLink3Description: DigiKey; ComponentLink3URL: https://www.digikey.com/en/products/detail/rohm-semiconductor/BD2204GUL-E2/5210337